# EAGLE design stoplight (EAGLE 9.1.3)
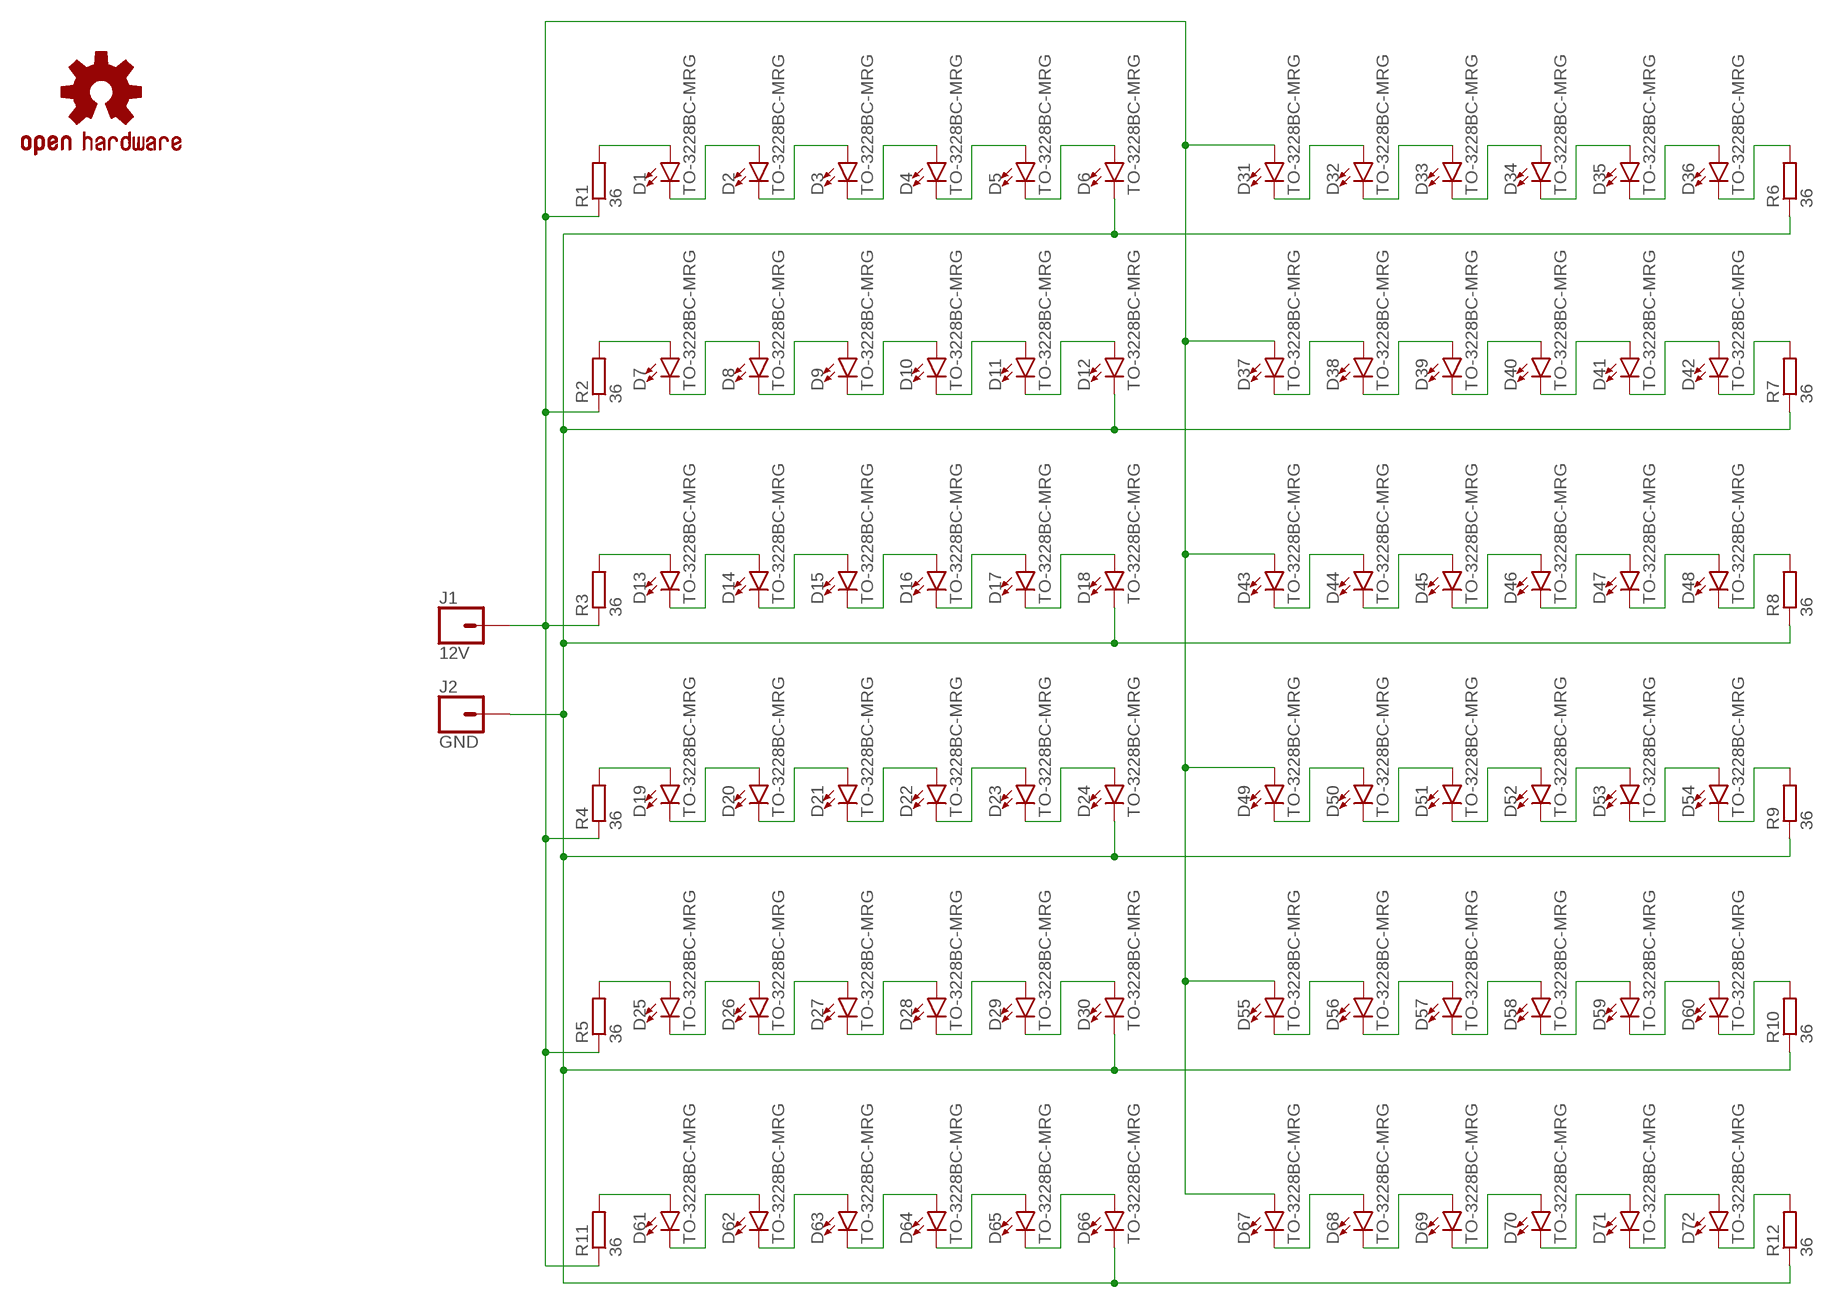
[diagram p0: schematic, sheet 1]

## Parts
D1  TO-3228BC-MRG  [TO-3228BC]
D2  TO-3228BC-MRG  [TO-3228BC]
D3  TO-3228BC-MRG  [TO-3228BC]
D4  TO-3228BC-MRG  [TO-3228BC]
D5  TO-3228BC-MRG  [TO-3228BC]
D6  TO-3228BC-MRG  [TO-3228BC]
D7  TO-3228BC-MRG  [TO-3228BC]
D8  TO-3228BC-MRG  [TO-3228BC]
D9  TO-3228BC-MRG  [TO-3228BC]
D10  TO-3228BC-MRG  [TO-3228BC]
D11  TO-3228BC-MRG  [TO-3228BC]
D12  TO-3228BC-MRG  [TO-3228BC]
D13  TO-3228BC-MRG  [TO-3228BC]
D14  TO-3228BC-MRG  [TO-3228BC]
D15  TO-3228BC-MRG  [TO-3228BC]
D16  TO-3228BC-MRG  [TO-3228BC]
D17  TO-3228BC-MRG  [TO-3228BC]
D18  TO-3228BC-MRG  [TO-3228BC]
D19  TO-3228BC-MRG  [TO-3228BC]
D20  TO-3228BC-MRG  [TO-3228BC]
D21  TO-3228BC-MRG  [TO-3228BC]
D22  TO-3228BC-MRG  [TO-3228BC]
D23  TO-3228BC-MRG  [TO-3228BC]
D24  TO-3228BC-MRG  [TO-3228BC]
D25  TO-3228BC-MRG  [TO-3228BC]
D26  TO-3228BC-MRG  [TO-3228BC]
D27  TO-3228BC-MRG  [TO-3228BC]
D28  TO-3228BC-MRG  [TO-3228BC]
D29  TO-3228BC-MRG  [TO-3228BC]
D30  TO-3228BC-MRG  [TO-3228BC]
D31  TO-3228BC-MRG  [TO-3228BC]
D32  TO-3228BC-MRG  [TO-3228BC]
D33  TO-3228BC-MRG  [TO-3228BC]
D34  TO-3228BC-MRG  [TO-3228BC]
D35  TO-3228BC-MRG  [TO-3228BC]
D36  TO-3228BC-MRG  [TO-3228BC]
D37  TO-3228BC-MRG  [TO-3228BC]
D38  TO-3228BC-MRG  [TO-3228BC]
D39  TO-3228BC-MRG  [TO-3228BC]
D40  TO-3228BC-MRG  [TO-3228BC]
D41  TO-3228BC-MRG  [TO-3228BC]
D42  TO-3228BC-MRG  [TO-3228BC]
D43  TO-3228BC-MRG  [TO-3228BC]
D44  TO-3228BC-MRG  [TO-3228BC]
D45  TO-3228BC-MRG  [TO-3228BC]
D46  TO-3228BC-MRG  [TO-3228BC]
D47  TO-3228BC-MRG  [TO-3228BC]
D48  TO-3228BC-MRG  [TO-3228BC]
D49  TO-3228BC-MRG  [TO-3228BC]
D50  TO-3228BC-MRG  [TO-3228BC]
D51  TO-3228BC-MRG  [TO-3228BC]
D52  TO-3228BC-MRG  [TO-3228BC]
D53  TO-3228BC-MRG  [TO-3228BC]
D54  TO-3228BC-MRG  [TO-3228BC]
D55  TO-3228BC-MRG  [TO-3228BC]
D56  TO-3228BC-MRG  [TO-3228BC]
D57  TO-3228BC-MRG  [TO-3228BC]
D58  TO-3228BC-MRG  [TO-3228BC]
D59  TO-3228BC-MRG  [TO-3228BC]
D60  TO-3228BC-MRG  [TO-3228BC]
D61  TO-3228BC-MRG  [TO-3228BC]
D62  TO-3228BC-MRG  [TO-3228BC]
D63  TO-3228BC-MRG  [TO-3228BC]
D64  TO-3228BC-MRG  [TO-3228BC]
D65  TO-3228BC-MRG  [TO-3228BC]
D66  TO-3228BC-MRG  [TO-3228BC]
D67  TO-3228BC-MRG  [TO-3228BC]
D68  TO-3228BC-MRG  [TO-3228BC]
D69  TO-3228BC-MRG  [TO-3228BC]
D70  TO-3228BC-MRG  [TO-3228BC]
D71  TO-3228BC-MRG  [TO-3228BC]
D72  TO-3228BC-MRG  [TO-3228BC]
J1  12V  CONN_01PTH_LONGPAD  [1X01_LONGPAD]
J2  GND  CONN_01PTH_LONGPAD  [1X01_LONGPAD]
LOGO1  OSHW-LOGOS-COPPER  [OSHW-LOGO-S_COPPER]
R1  36  R-EU_R0805  [R0805]
R2  36  R-EU_R0805  [R0805]
R3  36  R-EU_R0805  [R0805]
R4  36  R-EU_R0805  [R0805]
R5  36  R-EU_R0805  [R0805]
R6  36  R-EU_R0805  [R0805]
R7  36  R-EU_R0805  [R0805]
R8  36  R-EU_R0805  [R0805]
R9  36  R-EU_R0805  [R0805]
R10  36  R-EU_R0805  [R0805]
R11  36  R-EU_R0805  [R0805]
R12  36  R-EU_R0805  [R0805]

## Nets
+12V [big]: D31.A D37.A D43.A D49.A D55.A D67.A J1.1 R1.1 R2.1 R3.1 R4.1 R5.1 R11.1
GND [big]: D6.C D12.C D18.C D24.C D30.C D66.C J2.1 R6.1 R7.1 R8.1 R9.1 R10.1 R12.1
N$2: D1.A R1.2
N$3: D1.C D2.A
N$4: D2.C D3.A
N$5: D3.C D4.A
N$6: D4.C D5.A
N$7: D5.C D6.A
N$8: D36.C R6.2
N$9: D7.A R2.2
N$10: D7.C D8.A
N$11: D8.C D9.A
N$12: D9.C D10.A
N$13: D10.C D11.A
N$14: D11.C D12.A
N$15: D31.C D32.A
N$16: D13.A R3.2
N$17: D13.C D14.A
N$18: D14.C D15.A
N$19: D15.C D16.A
N$20: D16.C D17.A
N$21: D17.C D18.A
N$22: D32.C D33.A
N$23: D19.A R4.2
N$24: D19.C D20.A
N$25: D20.C D21.A
N$26: D21.C D22.A
N$27: D22.C D23.A
N$28: D23.C D24.A
N$29: D33.C D34.A
N$30: D25.A R5.2
N$31: D25.C D26.A
N$32: D26.C D27.A
N$33: D27.C D28.A
N$34: D28.C D29.A
N$35: D29.C D30.A
N$36: D34.C D35.A
N$37: D35.C D36.A
N$38: D42.C R7.2
N$39: D37.C D38.A
N$40: D38.C D39.A
N$41: D39.C D40.A
N$42: D40.C D41.A
N$43: D41.C D42.A
N$44: D48.C R8.2
N$45: D43.C D44.A
N$46: D44.C D45.A
N$47: D45.C D46.A
N$48: D46.C D47.A
N$49: D47.C D48.A
N$50: D54.C R9.2
N$51: D49.C D50.A
N$52: D50.C D51.A
N$53: D51.C D52.A
N$54: D52.C D53.A
N$55: D53.C D54.A
N$56: D60.C R10.2
N$57: D55.C D56.A
N$58: D56.C D57.A
N$59: D57.C D58.A
N$60: D58.C D59.A
N$61: D59.C D60.A
N$62: D61.A R11.2
N$63: D61.C D62.A
N$64: D62.C D63.A
N$65: D63.C D64.A
N$66: D64.C D65.A
N$67: D65.C D66.A
N$68: D67.C D68.A
N$69: D68.C D69.A
N$70: D69.C D70.A
N$71: D70.C D71.A
N$72: D71.C D72.A
N$73: D72.C R12.2

## Library data of the parts
D1-D72 = stoplight:TO-3228BC: OASISTEK 3228 LED - 940nm Beam Angle:120 degree Forward Current:20mA Forward Voltage:2.0V Variants: MRG: Ultra Bright Red 625nm chipdip.ru <https://www.chipdip.ru/product/to-3228bc-mrg>; MPN: TO-3228BC-MRG
J1 J2 = SparkFun-Connectors:CONN_01: Single connection point. Often used as Generic Header-pin footprint for 0.1 inch spaced/style header connections On any of the 0.1 inch spaced packages, you can populate with these: Break Away Headers - Straight <https://www.sparkfun.com/products/116> (PRT-00116) Break Away Male Headers - Right Angle <https://www.sparkfun.com/products/553> (PRT-00553) Female Headers <https://www.sparkfun.com/products/115> (PRT-00115) Break Away Headers - Machine Pin <https://www.sparkfun.com/products/117> (PRT-00117) Break Away Female Headers - Swiss Machine Pin <https://www.sparkfun.com/products/743> (PRT-00743) This device is also useful as a general connection point to wire up your design to another part of your project. Our various solder wires solder well into these plated through hole pads. Hook-Up Wire - Assortment (Stranded, 22 AWG) <https://www.sparkfun.com/products/11375> (PRT-11375) Hook-Up Wire - Assortment (Solid Core, 22 AWG) <https://www.sparkfun.com/products/11367> (PRT-11367) View the entire wire category on our website here <https://www.sparkfun.com/categories/141> Special notes: SMTSO-256-ET is a "flush mount" nut for a 4-40 screw. We mostly use this on specialty testbeds; it is a nice way to connect hardware to your PCB at an adjustable hieght. Also note, the SNAP packages are for using a snappable style connector. We sell a baggie of snaps and they are also used on two LilyPad designs: Snap Assortment - 30 pack (male and female) <https://www.sparkfun.com/products/11347> (DEV-11347) LilyPad Arduino SimpleSnap <https://www.sparkfun.com/products/10941> (DEV-10941) LilyPad SimpleSnap Protoboard <https://www.sparkfun.com/products/10940> (DEV-10940)
LOGO1 = SparkFun-Aesthetics:OSHW-LOGO: Open-Source Hardware (OSHW) Logo This logo indicates the piece of hardware it is found on incorporates a OSHW license and/or adheres to the definition of open source hardware found here: http://freedomdefined.org/OSHW
R1-R12 = rcl:R-EU_: RESISTOR, European symbol

## Net classes
0 default: width 0.5 mm, drill 0.4 mm, clearance 0.4 mm
1 big: width 0.8 mm, drill 0.4 mm, clearance 0.4 mm

## Board
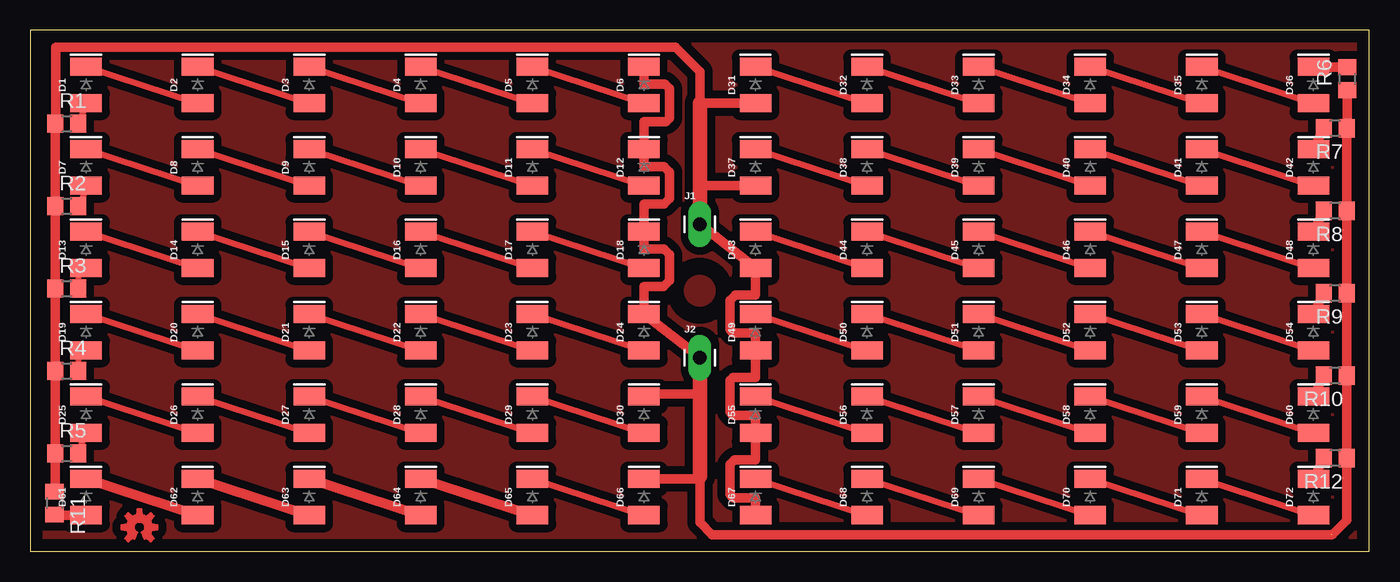
[diagram p1: board, top side]

Size 110.4 x 43 mm. Coordinates in mm from the lower left corner, seen from the top.
Outline: 0,0 110.4,0 110.4,43 0,43 0,0
Copper layers (1*16): Top 0.035mm / dielectric 1.5mm / Bottom 0.035mm
Design rules "default": minimum track width 6mil, minimum drill 0.35mm, track to track 6mil, track to pad 6mil, pad to pad 6mil, via to via 6mil, smd to smd 6mil, copper to edge 40mil, drill to drill 6mil, minimum pad ring 10mil, minimum via ring 8mil, stop-mask expansion 4mil, vias tented up to drill 0mil, thermal gap 10mil
tRestrict: area 53.2,19.5 to 57.2,23.5

### Footprints (pad centres in the part's own frame; a part is rotated, then mirrored left to right if it is on the bottom)
TO-3228BC = smd 1.5 x 2.6: A -1.5,0; C 1.5,0
1X01_LONGPAD = drill 1.118 pad 1.88 long: 1 0,0
R0805 = smd 1.3 x 1.5: 1 -0.95,0; 2 0.95,0

### Placement (x,y rotation side)
D1  4.6,38.5 90 top
D2  13.8,38.5 90 top
D3  23,38.5 90 top
D4  32.2,38.5 90 top
D5  41.4,38.5 90 top
D6  50.6,38.5 90 top
D7  4.6,31.7 90 top
D8  13.8,31.7 90 top
D9  23,31.7 90 top
D10  32.2,31.7 90 top
D11  41.4,31.7 90 top
D12  50.6,31.7 90 top
D13  4.6,24.9 90 top
D14  13.8,24.9 90 top
D15  23,24.9 90 top
D16  32.2,24.9 90 top
D17  41.4,24.9 90 top
D18  50.6,24.9 90 top
D19  4.6,18.1 90 top
D20  13.8,18.1 90 top
D21  23,18.1 90 top
D22  32.2,18.1 90 top
D23  41.4,18.1 90 top
D24  50.6,18.1 90 top
D25  4.6,11.3 90 top
D26  13.8,11.3 90 top
D27  23,11.3 90 top
D28  32.2,11.3 90 top
D29  41.4,11.3 90 top
D30  50.6,11.3 90 top
D31  59.8,38.5 90 top
D32  69,38.5 90 top
D33  78.2,38.5 90 top
D34  87.4,38.5 90 top
D35  96.6,38.5 90 top
D36  105.8,38.5 90 top
D37  59.8,31.7 90 top
D38  69,31.7 90 top
D39  78.2,31.7 90 top
D40  87.4,31.7 90 top
D41  96.6,31.7 90 top
D42  105.8,31.7 90 top
D43  59.8,24.9 90 top
D44  69,24.9 90 top
D45  78.2,24.9 90 top
D46  87.4,24.9 90 top
D47  96.6,24.9 90 top
D48  105.8,24.9 90 top
D49  59.8,18.1 90 top
D50  69,18.1 90 top
D51  78.2,18.1 90 top
D52  87.4,18.1 90 top
D53  96.6,18.1 90 top
D54  105.8,18.1 90 top
D55  59.8,11.3 90 top
D56  69,11.3 90 top
D57  78.2,11.3 90 top
D58  87.4,11.3 90 top
D59  96.6,11.3 90 top
D60  105.8,11.3 90 top
D61  4.6,4.5 90 top
D62  13.8,4.5 90 top
D63  23,4.5 90 top
D64  32.2,4.5 90 top
D65  41.4,4.5 90 top
D66  50.6,4.5 90 top
D67  59.8,4.5 90 top
D68  69,4.5 90 top
D69  78.2,4.5 90 top
D70  87.4,4.5 90 top
D71  96.6,4.5 90 top
D72  105.8,4.5 90 top
J1  55.2,27 0 top
J2  55.2,16 0 top
LOGO1  9,2 0 top
R1  3,35.3 0 top
R2  3,28.5 0 top
R3  3,21.7 0 top
R4  3,14.9 0 top
R5  3,8.1 0 top
R6  108.6,39 90 top
R7  107.6,34.9 180 top
R8  107.6,28.1 180 top
R9  107.6,21.3 180 top
R10  107.6,14.5 180 top
R11  2,4 270 top
R12  107.6,7.7 180 top

### Tracks (layer width: path | path; a pad name or v marks a point on that pad's centre or on a via)
+12V
  Top 0.8: 55.2,37 55.2,39.58 53.2,41.6 2.1,41.6 2.1,35.25 R1.1 R2.1 R3.1 R4.1 2.05,11.4 R5.1 2.05,5 R11.1 | 55.3,35.9 55.2,35.8 | 55.2,37 | D31.A 55.2,37 | D37.A 55.4,30.2 55.2,30 | J1.1 D43.A 59.8,21.15 58.15,21.15 57.7,20.7 57.7,18.3 57.95,18.05 59.8,18.05 D49.A 59.8,14.35 57.95,14.35 57.7,14.1 57.7,11.5 57.95,11.25 59.8,11.25 D55.A 59.8,7.55 58.05,7.55 57.7,7.2 57.7,4.7 57.95,4.45 59.8,4.45 D67.A
  Top 1.2: J1.1 55.2,28 55.2,30 55.2,35.8 55.2,37
GND  (1 unrouted)
  Top 0.8: 55.2,6 55.2,2.42 56.2,1.4 107.3,1.4 | 55.2,6 55.2,6.2 55.1,6.1 | 107.3,1.42 107.4,1.42 108.55,2.57 R12.1 R10.1 108.55,21.1 R9.1 R8.1 R7.1 108.6,34.95 R6.1 | D66.C 55.2,6 | D30.C 50.8,13 55.2,13 | J2.1 D24.C 50.6,21.85 52.2,21.85 52.7,22.35 52.7,24.5 52.25,24.95 50.6,24.95 D18.C 50.6,28.65 52.25,28.65 52.7,29.1 52.7,31.3 52.25,31.75 50.6,31.75 D12.C 50.6,35.45 52.4,35.45 52.7,35.75 52.7,38.2 52.35,38.55 50.6,38.55 D6.C
  Top 1.2: 55.2,6.2 55.2,13 55.2,14 J2.1
N$1
  pour Top (isolate 0.65): 0,43 0,0 110.4,0 110.4,43
N$2
  Top 0.5: D1.A 3.95,35.25 R1.2
N$3
  Top 0.5: D1.C D2.A
N$4
  Top 0.5: D2.C D3.A
N$5
  Top 0.5: D3.C D4.A
N$6
  Top 0.5: D4.C D5.A
N$7
  Top 0.5: D5.C D6.A
N$8
  Top 0.8: D36.C 105.85,39.95 R6.2
N$9
  Top 0.5: R2.2 4.43,29.44 D7.A
N$10
  Top 0.5: D7.C D8.A
N$11
  Top 0.5: D8.C D9.A
N$12
  Top 0.5: D9.C D10.A
N$13
  Top 0.5: D10.C D11.A
N$14
  Top 0.5: D11.C D12.A
N$15
  Top 0.5: D31.C D32.A
N$16
  Top 0.5: R3.2 3.95,22.75 D13.A
N$17
  Top 0.5: D13.C D14.A
N$18
  Top 0.5: D14.C D15.A
N$19
  Top 0.5: D15.C D16.A
N$20
  Top 0.5: D16.C D17.A
N$21
  Top 0.5: D17.C D18.A
N$22
  Top 0.5: D32.C D33.A
N$23
  Top 0.5: R4.2 3.95,15.95 D19.A
N$24
  Top 0.5: D19.C D20.A
N$25
  Top 0.5: D20.C D21.A
N$26
  Top 0.5: D21.C D22.A
N$27
  Top 0.5: D22.C D23.A
N$28
  Top 0.5: D23.C D24.A
N$29
  Top 0.5: D33.C D34.A
N$30
  Top 0.5: R5.2 D25.A
N$31
  Top 0.5: D25.C D26.A
N$32
  Top 0.5: D26.C D27.A
N$33
  Top 0.5: D27.C D28.A
N$34
  Top 0.5: D28.C D29.A
N$35
  Top 0.5: D29.C D30.A
N$36
  Top 0.5: D34.C D35.A
N$37
  Top 0.5: D35.C D36.A
N$38
  Top 0.8: R7.2 D42.C
N$39
  Top 0.5: D37.C D38.A
N$40
  Top 0.5: D38.C D39.A
N$41
  Top 0.5: D39.C D40.A
N$42
  Top 0.5: D40.C D41.A
N$43
  Top 0.5: D41.C D42.A
N$44
  Top 0.8: R8.2 D48.C
N$45
  Top 0.5: D43.C D44.A
N$46
  Top 0.5: D44.C D45.A
N$47
  Top 0.5: D45.C D46.A
N$48
  Top 0.5: D46.C D47.A
N$49
  Top 0.5: D47.C D48.A
N$50
  Top 0.8: R9.2 D54.C
N$51
  Top 0.5: D49.C D50.A
N$52
  Top 0.5: D50.C D51.A
N$53
  Top 0.5: D51.C D52.A
N$54
  Top 0.5: D52.C D53.A
N$55
  Top 0.5: D53.C D54.A
N$56
  Top 0.8: R10.2 D60.C
N$57
  Top 0.5: D55.C D56.A
N$58
  Top 0.5: D56.C D57.A
N$59
  Top 0.5: D57.C D58.A
N$60
  Top 0.5: D58.C D59.A
N$61
  Top 0.5: D59.C D60.A
N$62
  Top 0.8: R11.2 2.05,3 D61.A
N$63
  Top 0.8: D61.C D62.A
N$64
  Top 0.8: D62.C D63.A
N$65
  Top 0.8: D63.C D64.A
N$66
  Top 0.8: D64.C D65.A
N$67
  Top 0.5: D65.C D66.A
N$68
  Top 0.5: D67.C D68.A
N$69
  Top 0.5: D68.C D69.A
N$70
  Top 0.5: D69.C D70.A
N$71
  Top 0.5: D70.C D71.A
N$72
  Top 0.5: D71.C D72.A
N$73
  Top 0.8: R12.2 D72.C